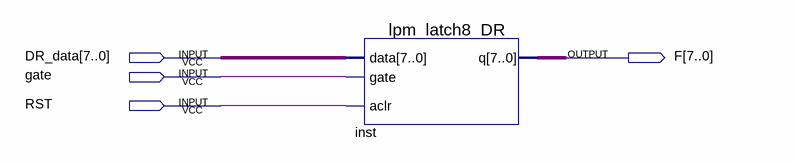
[diagram p0: schematic sheet]
// Quartus schematic DR.bdf as structural Verilog: 1 symbols, 4 pins
module DR (
  input  [7:0] DR_data,
  input  gate,
  input  RST,
  output [7:0] F
);

  lpm_latch8_DR inst (.data(DR_data), .gate(gate), .aclr(RST), .q(F));
endmodule
